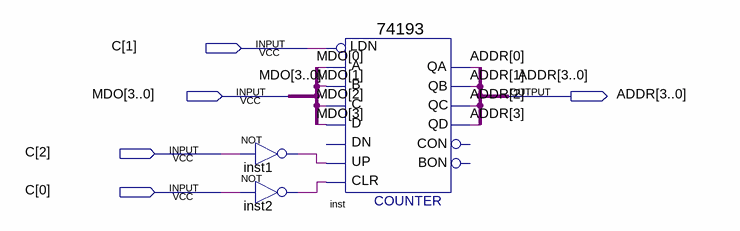
[diagram p0: schematic sheet]
// Quartus schematic PC.bdf as structural Verilog: 3 symbols, 5 pins
module PC (
  input  [2:0] C,
  input  [3:0] MDO,
  output [3:0] ADDR
);

  wire inst1_out, inst2_out;

  not inst1 (inst1_out, C[2]);
  not inst2 (inst2_out, C[0]);
  \74193  inst (
    .D(MDO[3]), .C(MDO[2]), .B(MDO[1]), .A(MDO[0]), .CLR(inst2_out), .UP(inst1_out), .LDN(C[1]),
    .QB(ADDR[1]), .QA(ADDR[0]), .QD(ADDR[3]), .QC(ADDR[2]));  // open: DN, CON, BON
endmodule
